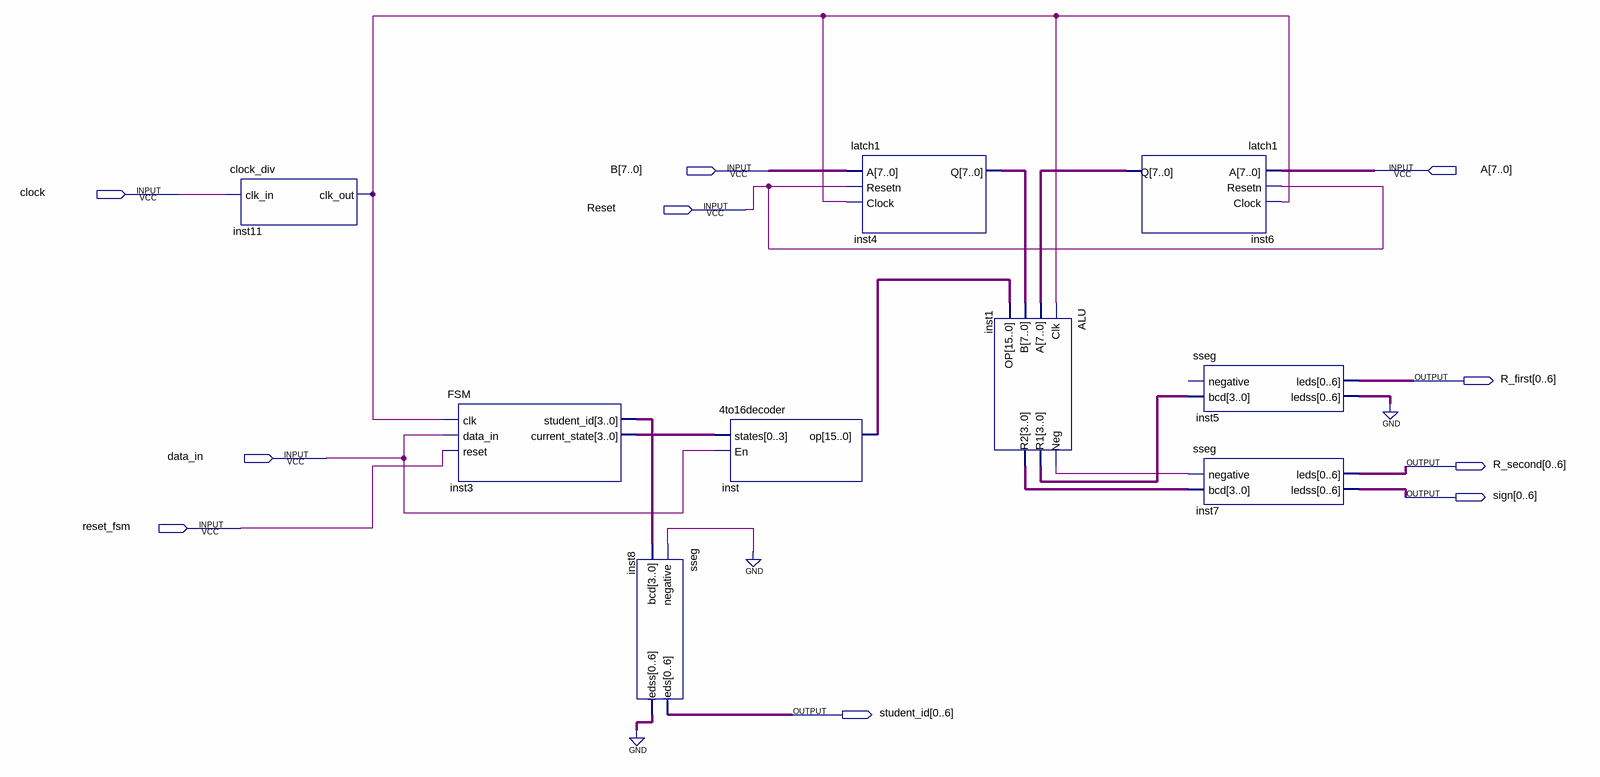
[diagram p0: schematic sheet]
// Quartus schematic problem1.bdf as structural Verilog: 9 symbols, 10 pins
module problem1 (
  input  [7:0] B,
  input  [7:0] A,
  input  clock,
  input  Reset,
  input  data_in,
  input  reset_fsm,
  output [0:6] R_first,
  output [0:6] R_second,
  output [0:6] sign,
  output [0:6] student_id
);

  wire inst1_neg, inst11_clk_out;
  wire [3:0] inst1_r1, inst1_r2, inst3_current_state, inst3_student_id;
  wire [6:0] inst5_ledss, inst8_ledss;
  wire [7:0] inst4_q, inst6_q;
  wire [15:0] inst_op;

  clock_div inst11 (.clk_in(clock), .clk_out(inst11_clk_out));
  FSM inst3 (
    .clk(inst11_clk_out), .data_in(data_in), .reset(reset_fsm), .student_id(inst3_student_id),
    .current_state(inst3_current_state));
  sseg inst8 (.negative(1'b0), .bcd(inst3_student_id), .leds(student_id), .ledss(inst8_ledss));
  \4to16decoder  inst (.states(inst3_current_state), .En(data_in), .op(inst_op));
  latch1 inst4 (.A(B), .Resetn(Reset), .Clock(inst11_clk_out), .Q(inst4_q));
  ALU inst1 (
    .Clk(inst11_clk_out), .A(inst6_q), .B(inst4_q), .OP(inst_op), .Neg(inst1_neg), .R1(inst1_r1),
    .R2(inst1_r2));
  latch1 inst6 (.A(A), .Resetn(Reset), .Clock(inst11_clk_out), .Q(inst6_q));
  sseg inst5 (.bcd(inst1_r1), .leds(R_first), .ledss(inst5_ledss));  // open: negative
  sseg inst7 (.negative(inst1_neg), .bcd(inst1_r2), .leds(R_second), .ledss(sign));
  // also tied to GND on the sheet: {inst8_ledss[0], inst8_ledss[1], inst8_ledss[2], inst8_ledss[3], inst8_ledss[4], inst8_ledss[5], inst8_ledss[6], inst5_ledss[0], inst5_ledss[1], inst5_ledss[2], inst5_ledss[3], inst5_ledss[4], inst5_ledss[5], inst5_ledss[6]}
endmodule
